# Altium schematic sheet ZLS-020.SchDoc: ZLS-020
size OrCAD A; Revision: 1; SheetNumber: 1; SheetTotal: 1; DocumentName: ZLS-020; ProjectName: ZLS-020
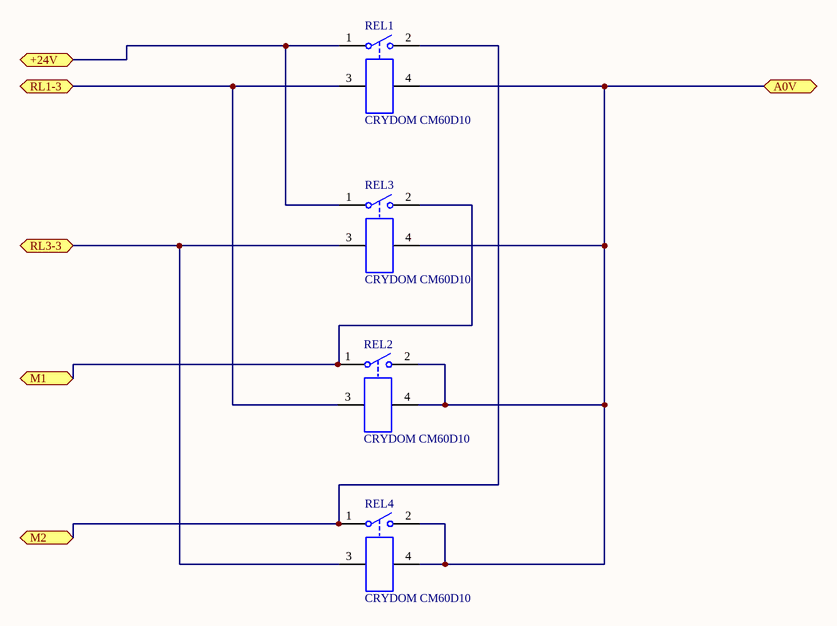
[diagram p0: ZLS-020.SchDoc]

## Parts
REL1  CRYDOM CM60D10  [MODULE4]
REL2  CRYDOM CM60D10  [MODULE4]
REL3  CRYDOM CM60D10  [MODULE4]
REL4  CRYDOM CM60D10  [MODULE4]

## Ports
+24V, A0V, M1, M2, RL1-3, RL3-3

## Nets
+24V: REL1.1 REL3.1 ; port +24V
A0V: REL1.4 REL2.2 REL2.4 REL3.4 REL4.2 REL4.4 ; port A0V
M1: REL2.1 REL3.2 ; port M1
M2: REL1.2 REL4.1 ; port M2
RL1-3: REL1.3 REL2.3 ; port RL1-3
RL3-3: REL3.3 REL4.3 ; port RL3-3

## Notes on the sheet
- Title
- Size:
- Date:
- Orcad A
- Number:
- Time:
- Revision:
- Sheet
- of
- ZLS Corporation
- 7801 North Lamar Blvd
- Suite E-184
- Austin, TX  78752
- Phone: (512) 453-0288
- File:

## Library data of the parts
REL1-REL4 = Relay-SPST: Single-Pole Single-Throw Relay; Published: 24-Mar-1999; LatestRevisionDate: 17-Jul-2002; LatestRevisionNote: Re-released for DXP Platform.; PackageReference: MODULE4; Publisher: Altium Limited